# EAGLE design Board settlemen (EAGLE 9.6.2)
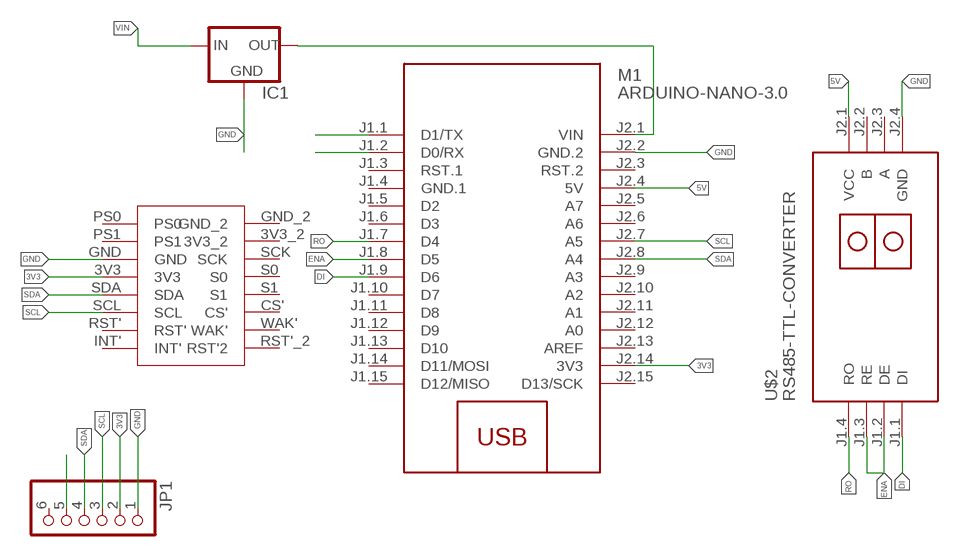
[diagram p0: schematic, sheet 1]

## Parts
IC1  78MXXS  [78MXXS]
JP1  PINHD-1X6  [1X06]
M1  ARDUINO-NANO-3.0  [ARDUINO-NANO-3.0]
U$1  BNO080  [BNO080]
U$2  RS485-TTL-CONVERTER  [RS485-TTL-CONVERTER]

## Nets
3V3: JP1.2 M1.J2.14(3V3) U$1.3V3
5V: M1.J2.4(5V) U$2.J2.1(VCC)
DI: M1.J1.9(D6) U$2.J1.1(DI)
ENA: M1.J1.8(D5) U$2.J1.2(DE) U$2.J1.3(RE)
GND: IC1.GND JP1.1 M1.J2.2(GND.2) U$1.GND U$2.J2.4(GND)
N$1: IC1.OUT M1.J2.1(VIN)
N$6: M1.J1.1(D1/TX)
N$7: M1.J1.2(D0/RX)
N$8: JP1.5
RO: M1.J1.7(D4) U$2.J1.4(RO)
SCL: JP1.3 M1.J2.7(A5) U$1.SCL
SDA: JP1.4 M1.J2.8(A4) U$1.SDA
VIN: IC1.IN
Unconnected: JP1.6 M1.J1.3(RST.1) M1.J1.5(D2) M1.J1.6(D3) M1.J1.10(D7) M1.J1.11(D8) M1.J1.12(D9) M1.J1.13(D10) M1.J1.14(D11/MOSI) M1.J1.15(D12/MISO) M1.J2.3(RST.2) M1.J2.5(A7) M1.J2.6(A6) M1.J2.9(A3) M1.J2.10(A2) M1.J2.11(A1) M1.J2.12(A0) M1.J2.13(AREF) M1.J2.15(D13/SCK) U$1.3V3_2 U$1.CS' U$1.GND_2 U$1.INT' U$1.PS0 U$1.PS1 U$1.RST' U$1.RST'_2(RST'2) U$1.S0 U$1.S1 U$1.SCK U$1.WAK' U$2.J2.2(B) U$2.J2.3(A)

## Power pins joined to a net without a drawn wire
GND.1: M1.J1.4(GND.1)

## Library data of the parts
IC1 = v-reg:78MXXS: VOLTAGE REGULATOR
JP1 = pinhead:PINHD-1X6: PIN HEADER
M1 = diy-modules:ARDUINO-NANO-3.0: Arduino Nano 3.0 and compatible devices More details available here: https://www.arduino.cc/en/Main/ArduinoBoardNano Click here to find device on ebay.com <http://www.ebay.com/sch/arduino+nano>
U$1 = BNO080:BNO080
U$2 = diy-modules:RS485-TTL-CONVERTER: RS485 to TTL converter based on MAX485 chip

## Board
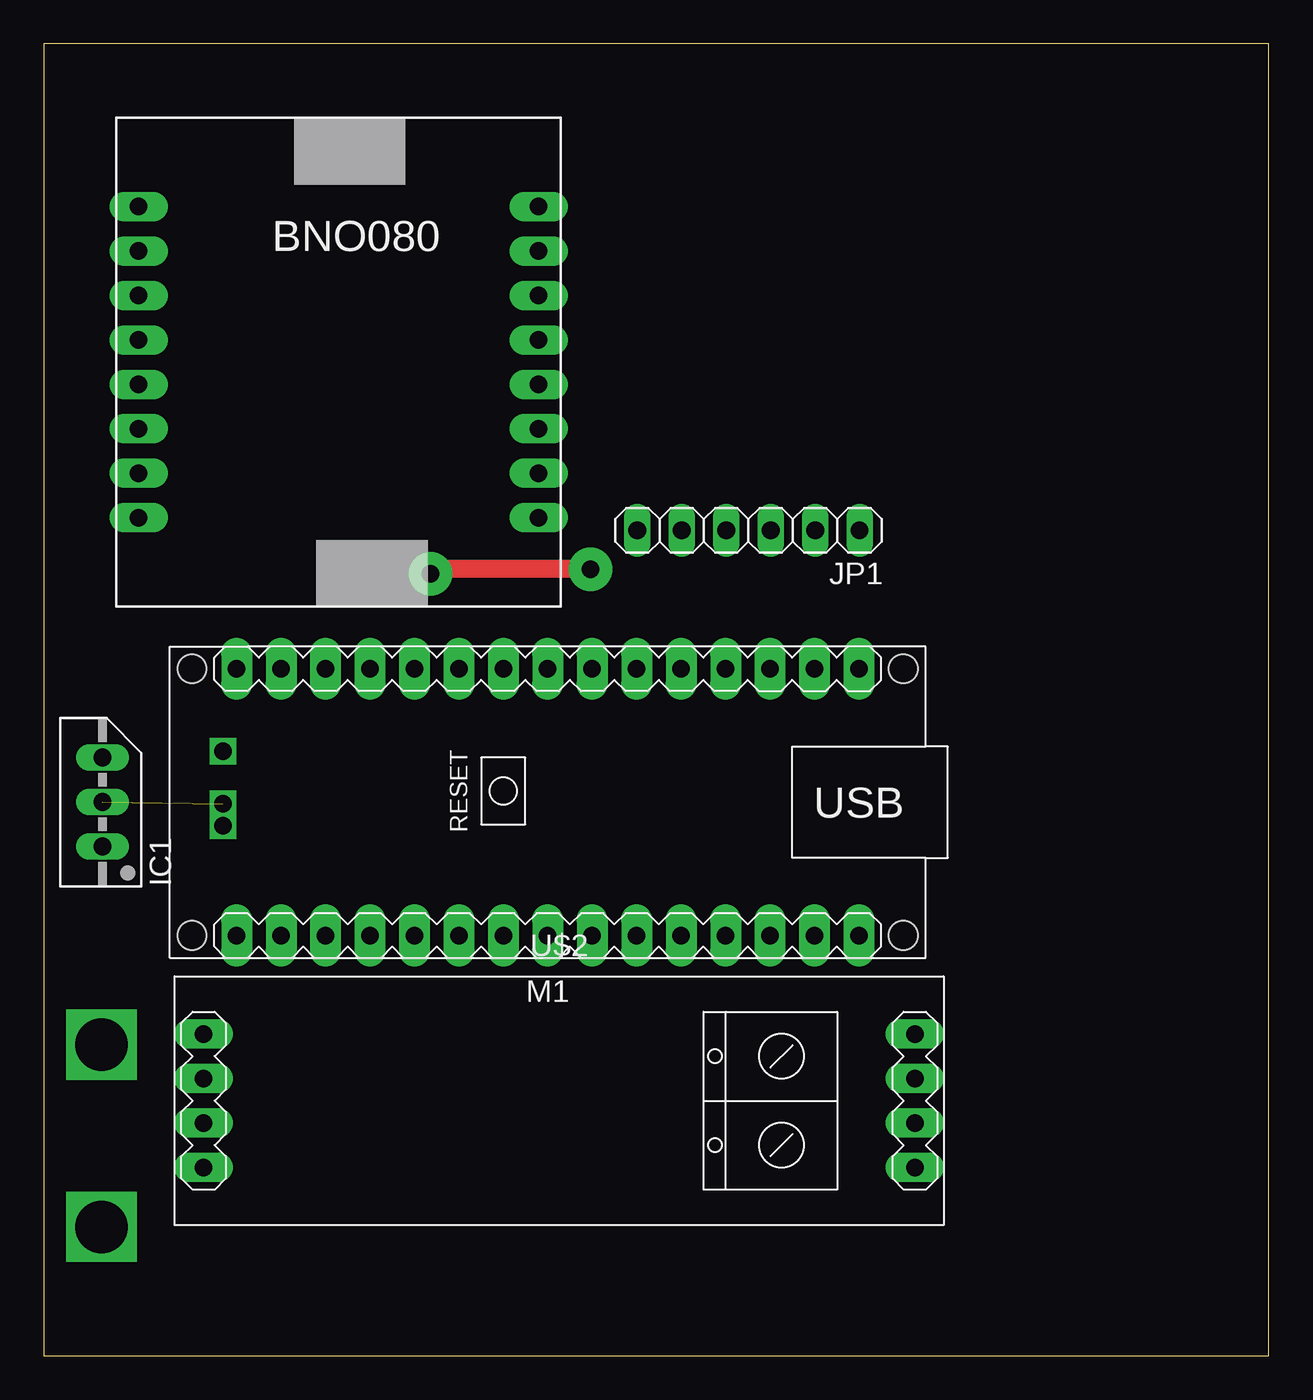
[diagram p1: board, top side]
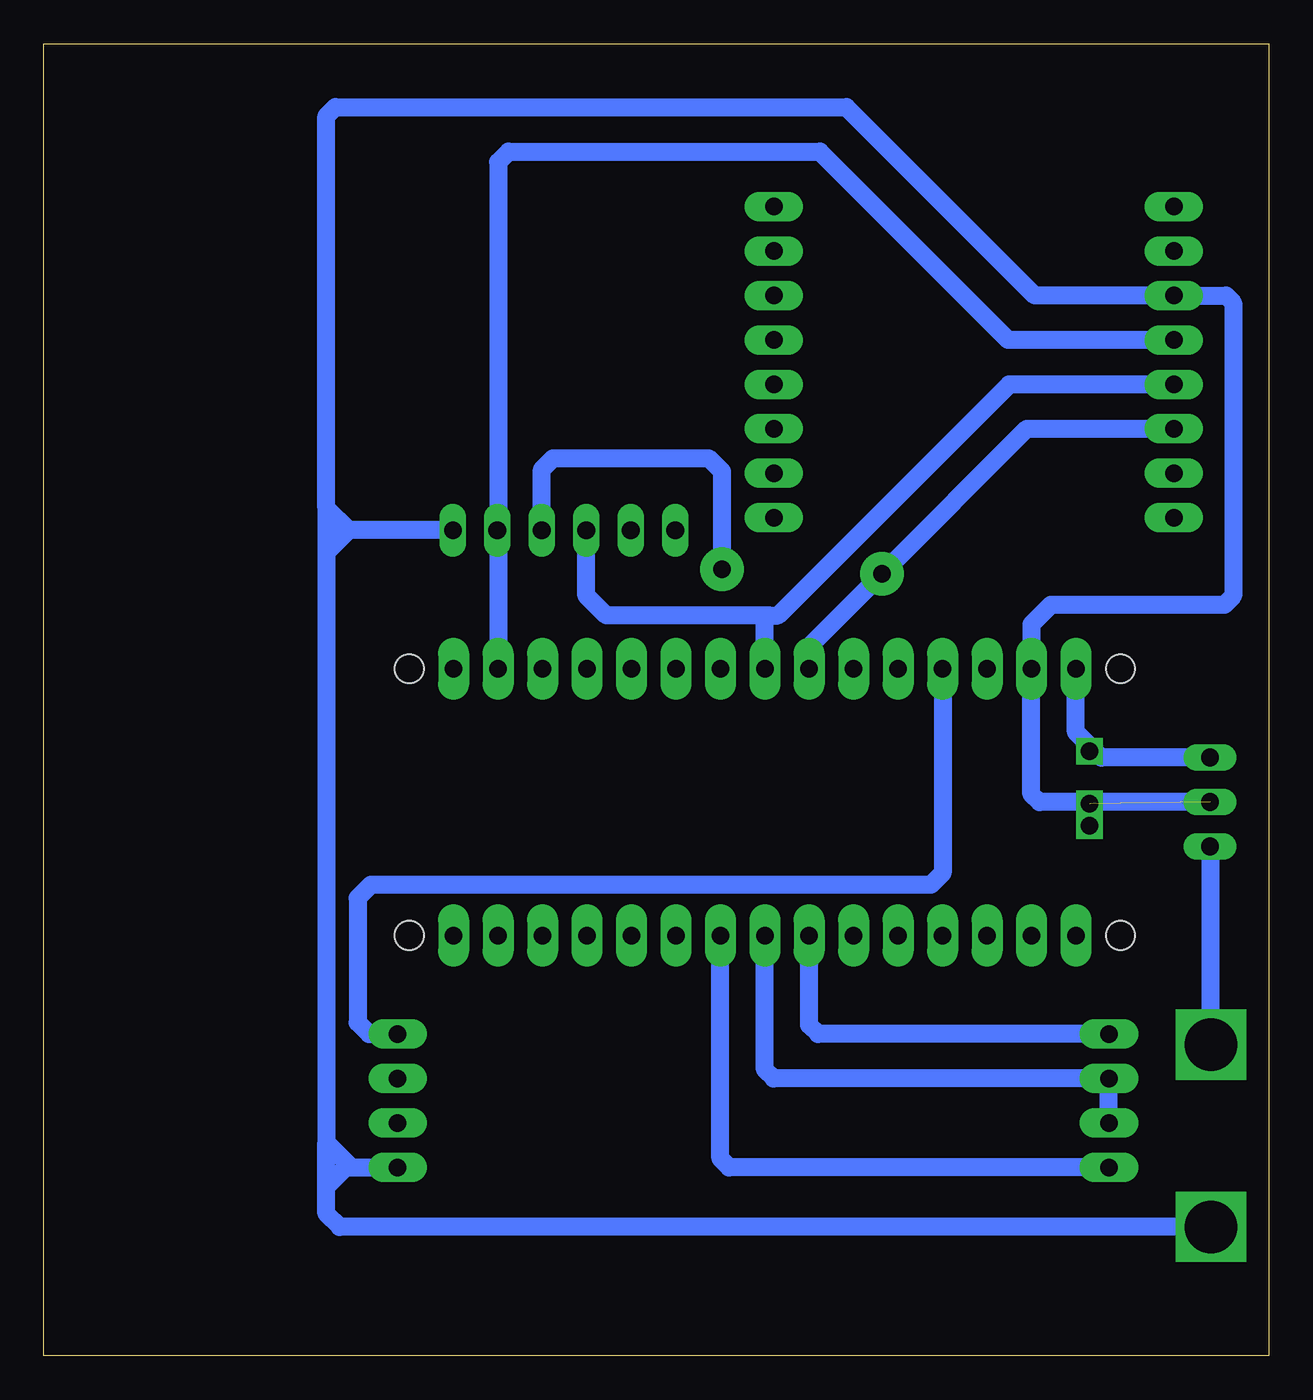
[diagram p2: board, bottom side, seen from below]

Size 70 x 75 mm. Coordinates in mm from the lower left corner, seen from the top.
Outline: 0,0 70,0 70,75 0,75 0,0
Copper layers (1*16): Top 0.035mm / dielectric 1.5mm / Bottom 0.035mm
Design rules "default": minimum track width 6mil, minimum drill 0.35mm, track to track 24mil, track to pad 24mil, pad to pad 24mil, via to via 24mil, smd to smd 24mil, copper to edge 40mil, drill to drill 6mil, minimum pad ring 10mil, minimum via ring 8mil, stop-mask expansion 4mil, vias tented up to drill 0mil, thermal gap 10mil

### Footprints (pad centres in the part's own frame; a part is rotated, then mirrored left to right if it is on the bottom)
78MXXS = drill 1.016 long: GND 0,-2.54; IN -2.54,-2.54; OUT 2.54,-2.54
1X06 = drill 1.016 long: 1 -6.35,0; 2 -3.81,0; 3 -1.27,0; 4 1.27,0; 5 3.81,0; 6 6.35,0
ARDUINO-NANO-3.0 = drill 1 pad 1.778 long: J1.1 17.78,7.62; J1.2 15.24,7.62; J1.3 12.7,7.62; J1.4 10.16,7.62; J1.5 7.62,7.62; J1.6 5.08,7.62; J1.7 2.54,7.62; J1.8 0,7.62; J1.9 -2.54,7.62; J1.10 -5.08,7.62; J1.11 -7.62,7.62; J1.12 -10.16,7.62; J1.13 -12.7,7.62; J1.14 -15.24,7.62; J1.15 -17.78,7.62; J2.1 17.78,-7.62; J2.2 15.24,-7.62; J2.3 12.7,-7.62; J2.4 10.16,-7.62; J2.5 7.62,-7.62; J2.6 5.08,-7.62; J2.7 2.54,-7.62; J2.8 0,-7.62; J2.9 -2.54,-7.62; J2.10 -5.08,-7.62; J2.11 -7.62,-7.62; J2.12 -10.16,-7.62; J2.13 -12.7,-7.62; J2.14 -15.24,-7.62; J2.15 -17.78,-7.62 | hole 1.651: -20.32,7.62; -20.32,-7.62; 20.32,-7.62; 20.32,7.62
BNO080 = drill 1 pad 1.676 long: 3V3 -10.16,-6.35; 3V3_2 12.7,-1.27; CS' 12.7,-11.43; GND -10.16,-3.81; GND_2 12.7,1.27; INT' -10.16,-16.51; PS0 -10.16,1.27; PS1 -10.16,-1.27; RST' -10.16,-13.97; RST'_2 12.7,-16.51; S0 12.7,-6.35; S1 12.7,-8.89; SCK 12.7,-3.81; SCL -10.16,-11.43; SDA -10.16,-8.89; WAK' 12.7,-13.97
RS485-TTL-CONVERTER = drill 1 pad 1.676 long: J1.1 -20.32,-3.81; J1.2 -20.32,-1.27; J1.3 -20.32,1.27; J1.4 -20.32,3.81; J2.1 20.32,3.81; J2.2 20.32,1.27; J2.3 20.32,-1.27; J2.4 20.32,-3.81

### Placement (x,y rotation side)
IC1  0.82,31.66 90 top
JP1  40.27,47.19 180 top
M1  28.8,31.65 180 top
U$1  15.58,64.42 0 top
U$2  29.46,14.58 0 top

### Tracks (layer width: path | path; a pad name or v marks a point on that pad's centre or on a via)
3V3
  Bottom 1.016: 44.04,47.23 44.04,68.23 43.43,68.83 25.65,68.83 14.89,58.07 U$1.3V3 | 44.04,47.23 M1.J2.14 | JP1.2 44.04,47.23
5V
  Bottom 1.016: M1.J2.4 18.64,27.59 19.3,26.92 51.31,26.92 52.07,26.16 52.07,19.05 51.41,18.39 U$2.J2.1
DI
  Bottom 1.016: U$2.J1.1 30.84,10.77 31.34,11.27 M1.J1.9
ENA
  Bottom 1.016: U$2.J1.2 U$2.J1.3 28.3,15.85 28.8,16.35 M1.J1.8
GND  (via drill 1, 3)  (1 unrouted)
  Bottom 1.016: IC1.GND 13.11,31.66 13.56,32.1 M1.J2.2 13.56,41.81 12.45,42.93 2.54,42.93 2.03,43.43 2.03,60.2 2.44,60.61 U$1.GND 13.36,60.61 24.13,71.37 53.34,71.37 53.85,70.87 53.85,48.46 | 53.85,48.46 53.85,46.74 | 53.85,46.74 53.85,45.97 | 53.85,45.97 53.85,12.19 | 53.85,12.19 52.43,10.77 | 52.43,10.77 U$2.J2.4 | JP1.1 52.58,47.19 | 52.58,47.19 53.39,47.19 53.85,46.74 | 52.58,47.19 53.85,48.46 | 52.58,47.19 53.8,45.97 53.85,45.97 | v3.3,7.37 53.09,7.37 53.85,8.13 53.85,9.65 | 53.85,9.65 53.85,12.19 | 53.85,9.65 52.73,10.77 52.43,10.77 | v10.24,31.56 v10.24,30.3
N$1  (via drill 1)
  Bottom 1.016: IC1.OUT 9.56,34.2 10.08,34.72 | M1.J2.1 11.02,35.66 10.08,34.72 | v10.24,34.56 10.08,34.72
RO
  Bottom 1.016: U$2.J1.4 25.76,18.39 26.26,18.89 M1.J1.7
SCL  (via drill 1 pad 2.5)
  Top 1.016: v31.24,44.96 22.35,44.96 v22.1,44.7
  Bottom 1.016: M1.J2.7 26.26,40.54 v22.1,44.7 13.82,52.99 U$1.SCL | JP1.3 41.54,50.66 40.89,51.31 32,51.31 31.24,50.55 v31.24,44.96
SDA
  Bottom 1.016: U$1.SDA 14.83,55.53 28.04,42.32 28.54,42.32 | M1.J2.8 28.8,42.07 28.54,42.32 | 28.54,42.32 37.85,42.32 38.96,43.43 39,43.43 JP1.4
VIN  (via drill 3)
  Bottom 1.016: IC1.IN 3.36,17.83 v3.3,17.78

### Text on the board
Vias: Settlement Plate IoT